# Altium schematic sheet [7]_ADC.SchDoc
size A; SheetNumber: 7; SheetTotal: 7
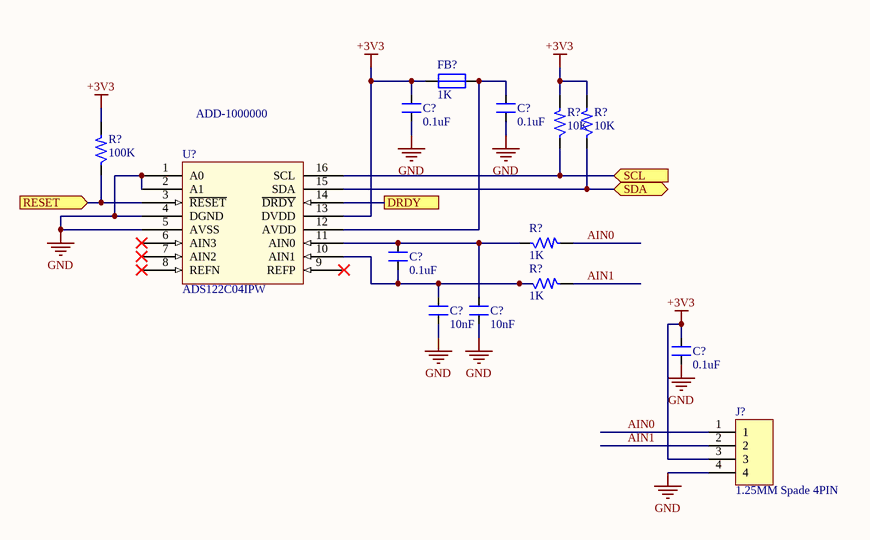
[diagram p0: [7]_ADC.SchDoc]

## Parts
(Parts that share a designator on the sheet are numbered #1, #2 ... from top to bottom, then left to right.)
C?#1  0.1uF  [CAP_0805]
C?#2  0.1uF  [CAP_0805]
C?#3  0.1uF  [CAP_0805]
C?#4  10nF  [CAP_0805]
C?#5  10nF  [CAP_0805]
C?#6  0.1uF  [CAP_0805]
FB?  1K  [IND_0805]
J?  1.25MM Spade 4PIN  [CON4_50_653004117322_TH_RA]
R?#1  10K  [RES_0603]
R?#2  10K  [RES_0603]
R?#3  100K  [RES_0603]
R?#4  1K  [RES_0603]
R?#5  1K  [RES_0603]
U?  ADS122C04IPW  [TSSOP16_25-59_294_54X14_SMT]

## Ports
DRDY, RESET (in), SCL (in), SDA (bidir)

## Nets
+3V3: C?#1.2 C?#6.2 FB?.1 J?.3 R?#1.2 R?#2.2 R?#3.2 U?.13(DVDD)
GND: C?#1.1 C?#2.1 C?#4.1 C?#5.1 C?#6.1 J?.4 U?.1(A0) U?.2(A1) U?.4(DGND) U?.5(AVSS)
AIN0: J?.1 R?#4.2
AIN1: J?.2 R?#5.2
DRDY: U?.14(~{DRDY}) ; port DRDY
RESET: R?#3.1 U?.3(~{RESET}) ; port RESET
SCL: R?#1.1 U?.16(SCL) ; port SCL
SDA: R?#2.1 U?.15(SDA) ; port SDA
NetC?#2_2: C?#2.2 FB?.2 U?.12(AVDD)
NetC?#3_1: C?#3.1 C?#4.2 R?#5.1 U?.10(AIN1)
NetC?#3_2: C?#3.2 C?#5.2 R?#4.1 U?.11(AIN0)

Not connected (* = marked no-connect by the designer): U? 6(AIN3)* 7(AIN2)* 8(REFN)* 9(REFP)*

## Notes on the sheet
- ADD-1000000

## Library data of the parts
C?#1-C?#3 C?#6 = CAP_0.1uF-50V-10%-0805: 0.1µF ±10% 50V Ceramic Capacitor X7R 0805 (2012 Metric); Manufacturer: Samsung; Manufacturer Part Number: CL21B104KBCNNNC; Alternate Part Number-1: NA; Case/Package: 0805; Supplier-1: SIRICOM; Supplier Part Number-1: 0805B104K500CT
C?#4 C?#5 = CAP_10nF-50V-10%-0805: 10000pF ±10% 50V Ceramic Capacitor X7R 0805 (2012 Metric); Manufacturer: Samsung; Manufacturer Part Number: C0805C103K5RECAUTO; Alternate Part Number-1: GRM2195C1H103JA01D; Case/Package: 0805; Supplier-1: SIRICOM; Supplier Part Number-1: 0805B103K500CT
FB? = FB_1K-100MHZ-1.6A-0805: 1 kOhms @ 100MHz 1 Power Line Ferrite Bead 0805 (2012 Metric) 1.6A; Manufacturer: Laird; Manufacturer Part Number: BLM21SP102SH1D; Alternate Part Number-1: NA; Case/Package: 0805; Supplier-1: SIRICOM; Supplier Part Number-1: ACMS201209A102
J? = CON-PLG_4X1-50-RA-TH: 4 Pins, 1 Row 1.25mm Pitch, right angle Connector, male; Manufacturer Part Number: 653004117322; Manufacturer: JST; Mating Part Number: 653004113322; Crimp Part Number: 653153128130; Alternate Part Number-1: NA; Case/Package: TH-CON; Supplier-1: WURTH; Supplier Part Number-1: 653004117322
R?#1 R?#2 = RES_10K-0.1W-1%-0603: 10 kOhms ±1% 0.1W, 1/10W Chip Resistor 0603 (1608 Metric) Automotive AEC-Q200 Thick Film; Manufacturer: Walsin; Manufacturer Part Number: WR06X1002FTL; Alternate Part Number-1: 0603WAJ0103T5E; Case/Package: 0603; Supplier-1: SIRICOM; Supplier Part Number-1: WR06X1002FTL
R?#3 = RES_100K-0.1W-1%-0603: 100 kOhms ±1% 0.1W, 1/10W Chip Resistor 0603 (1608 Metric) Automotive AEC-Q200 Thick Film; Manufacturer: Stackpole Electronics; Manufacturer Part Number: RMCF0603FT100K; Alternate Part Number-1: NA; Case/Package: 0603; Supplier-1: Arrow; Supplier Part Number-1: RMCF0603FT100K
R?#4 R?#5 = RES_1K-0.1W-1%-0603: 1 kOhms ±1% 0.1W, 1/10W Chip Resistor 0603 (1608 Metric) Automotive AEC-Q200 Thick Film; Manufacturer: Walsin; Manufacturer Part Number: WR06X1001FTL; Alternate Part Number-1: 0603WAF1001T5E; Case/Package: 0603; Supplier-1: SIRICOM; Supplier Part Number-1: WR06X1001FTL
U? = IC_ADS122C04IPW: 24 Bit Analog to Digital Converter 4 Input 1 Sigma-Delta 16-TSSOP; Manufacturer: Texas Instruments; Alternate Part Number-1: NA; Manufacturer Part Number: ADS122C04IPW; Case/Package: TSSOP16; Supplier-1: MOUSER; Supplier Part Number-1: ADS122C04IPW